# EAGLE design DevShield2.7.1 (EAGLE 6.4)
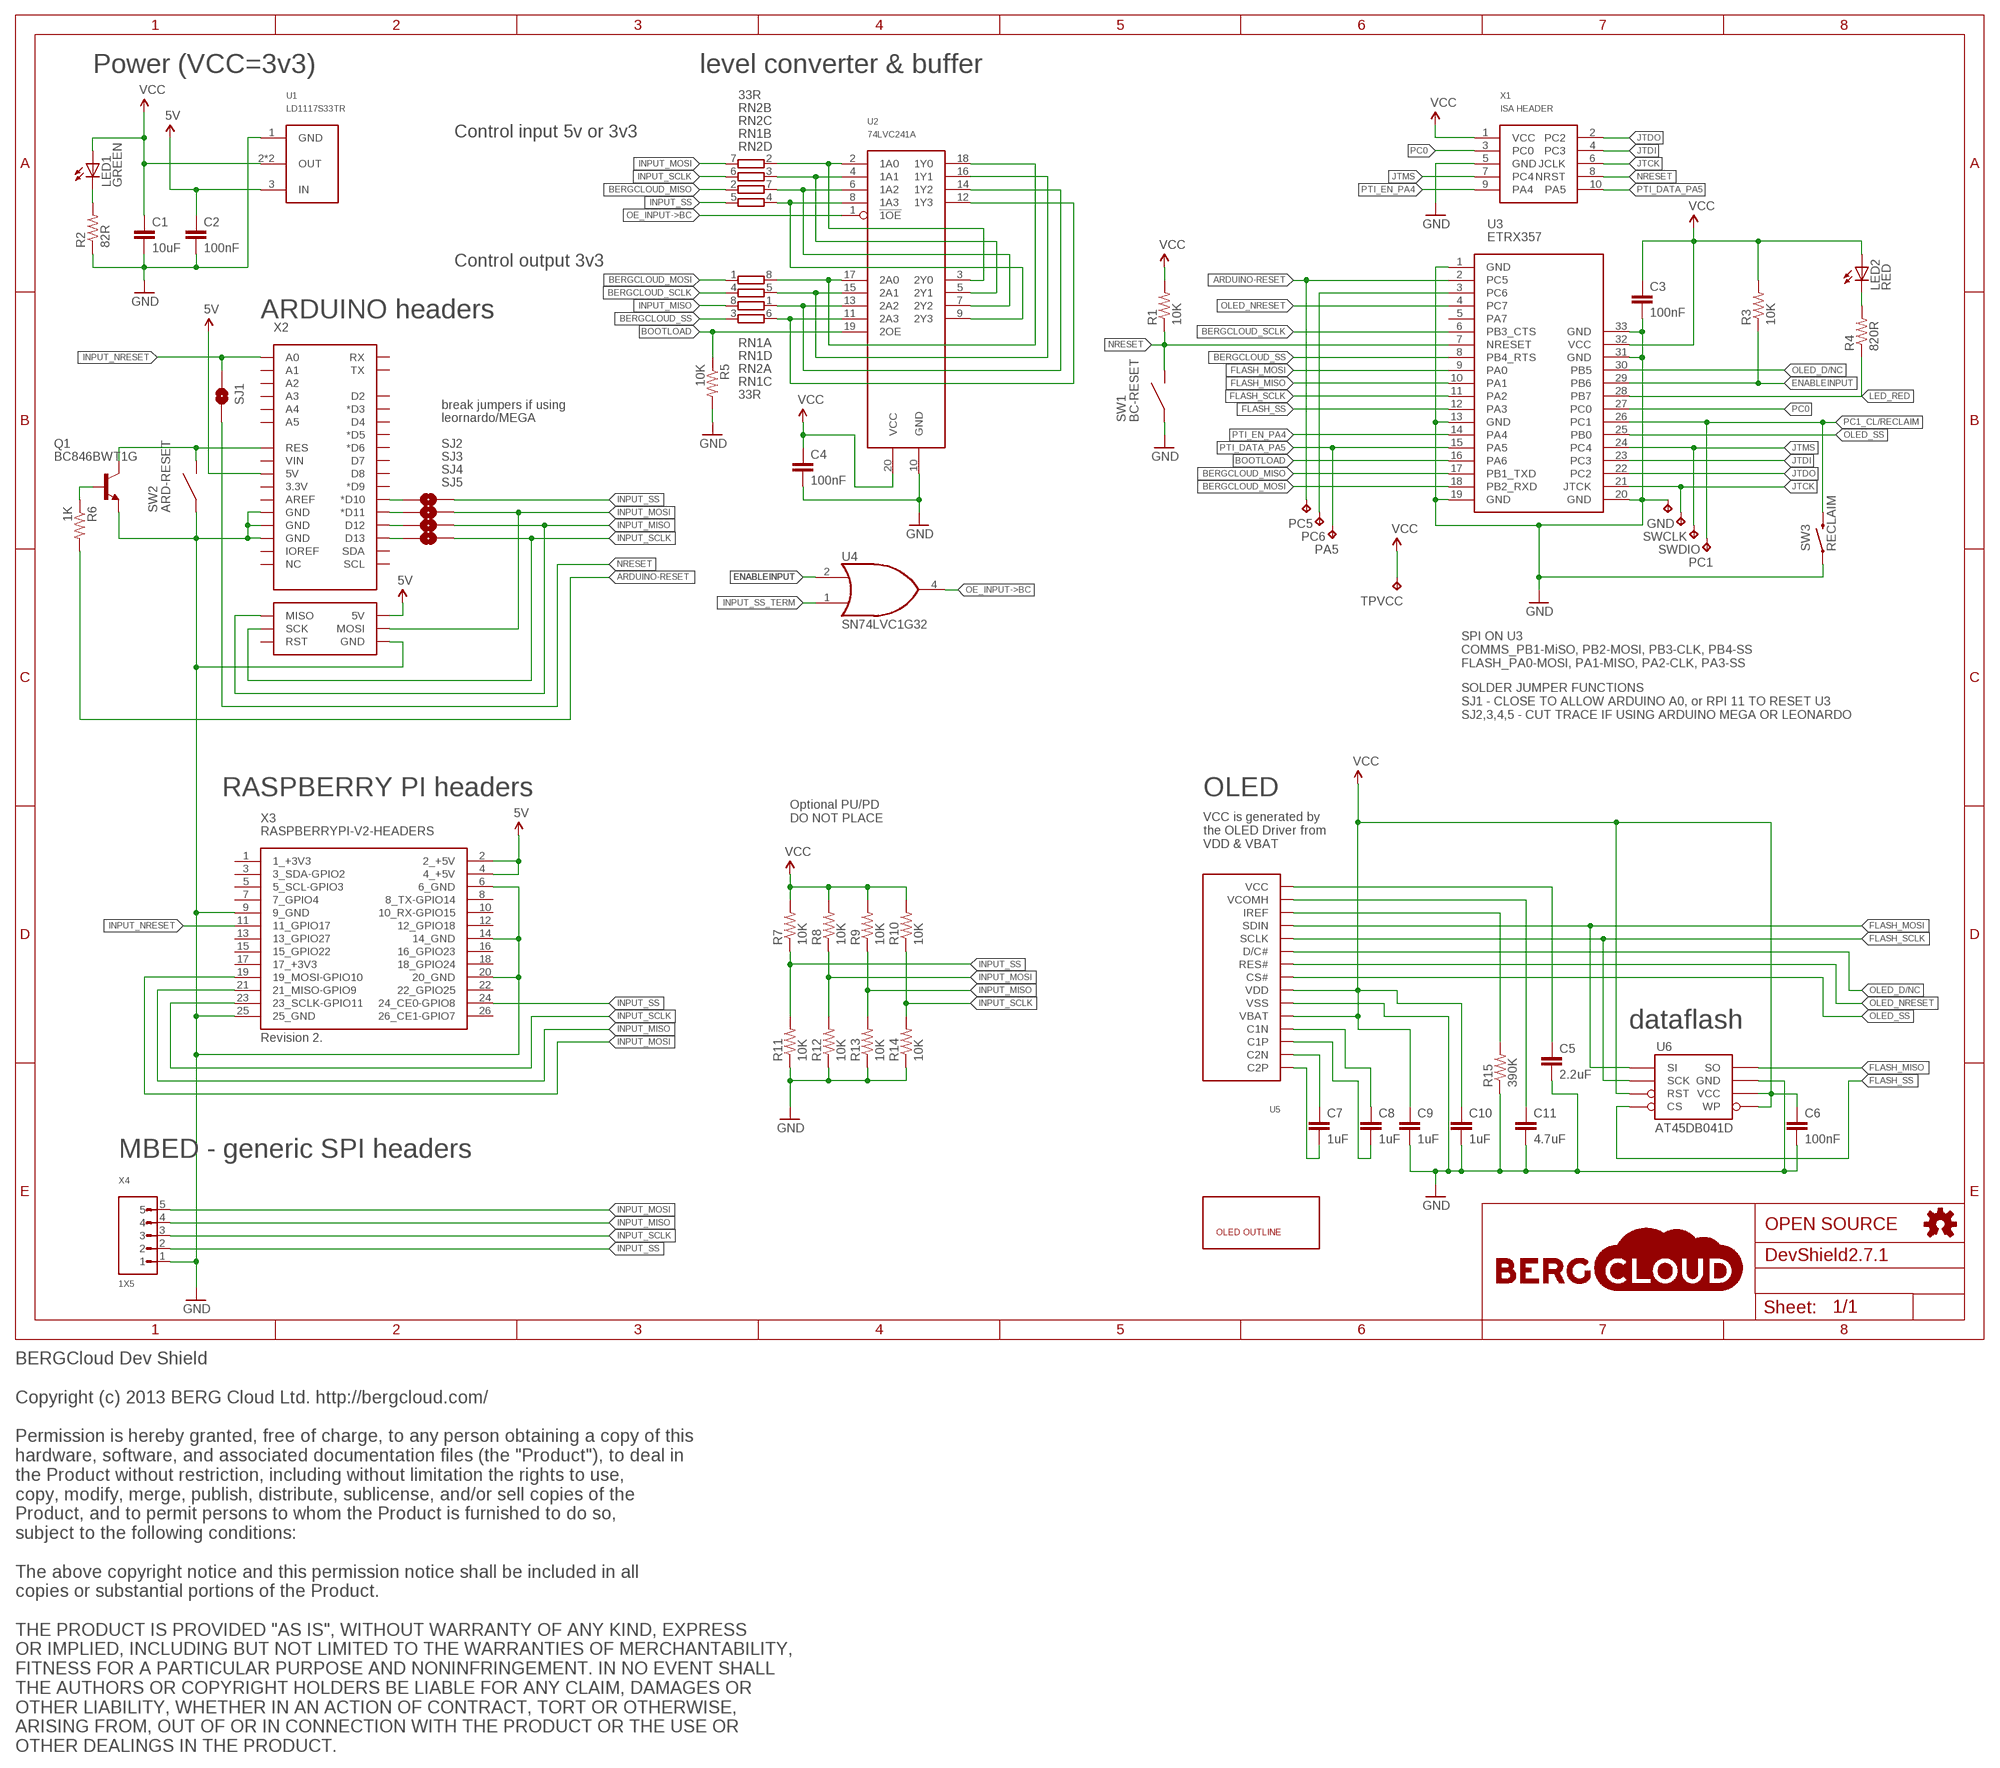
[diagram p0: schematic, sheet 1]

## Parts
C1  10uF  C-EUC0805K  [C0805K]
C2  100nF  C-EUC0603K  [C0603K]
C3  100nF  C-EUC0603K  [C0603K]
C4  100nF  C-EUC0603K  [C0603K]
C5  2.2uF  CAP0603-CAP  [0603-CAP]
C6  100nF  C-EUC0603K  [C0603K]
C7  1uF  CAP0603-CAP  [0603-CAP]
C8  1uF  CAP0603-CAP  [0603-CAP]
C9  1uF  CAP0603-CAP  [0603-CAP]
C10  1uF  CAP0603-CAP  [0603-CAP]
C11  4.7uF  CAP0805  [0805]
GND  TPTP15R  [TP15R]
IGNORE  ER-OLED0.91-1-OUTLINE  [ER-OLED0.91-SCREEN]
LED1  GREEN  LEDCHIPLED_0603  [CHIPLED_0603]
LED2  RED  LEDCHIPLED_0603  [CHIPLED_0603]
PA5  TPTP15R  [TP15R]
PC1  TPTP15R  [TP15R]
PC5  TPTP15R  [TP15R]
PC6  TPTP15R  [TP15R]
Q1  BC846BWT1G  [SOT323]
R1  10K  RESISTOR0603-RES  [0603-RES]
R2  82R  RESISTOR0603-RES  [0603-RES]
R3  10K  RESISTOR0603-RES  [0603-RES]
R4  820R  RESISTOR0603-RES  [0603-RES]
R5  10K  RESISTOR0603-RES  [0603-RES]
R6  1K  RESISTOR0603-RES  [0603-RES]
R7  10K  RESISTOR0603-RES  [0603-RES]
R8  10K  RESISTOR0603-RES  [0603-RES]
R9  10K  RESISTOR0603-RES  [0603-RES]
R10  10K  RESISTOR0603-RES  [0603-RES]
R11  10K  RESISTOR0603-RES  [0603-RES]
R12  10K  RESISTOR0603-RES  [0603-RES]
R13  10K  RESISTOR0603-RES  [0603-RES]
R14  10K  RESISTOR0603-RES  [0603-RES]
R15  390K  RESISTOR0603-RES  [0603-RES]
RN1  33R  4R-NCAT16  [CAT16]
RN2  33R  4R-NCAT16  [CAT16]
SJ1  SOLDERJUMPERNO  [SJ_2S-NO]
SJ2  SOLDERJUMPERTRACE  [SJ_2S-TRACE]
SJ3  SOLDERJUMPERTRACE  [SJ_2S-TRACE]
SJ4  SOLDERJUMPERTRACE  [SJ_2S-TRACE]
SJ5  SOLDERJUMPERTRACE  [SJ_2S-TRACE]
SW1  BC-RESET  SPST  [TE_FSMSM]
SW2  ARD-RESET  SPST  [TE_FSMSM]
SW3  RECLAIM  SWITCH-MOMENTARY-2SMD  [TACTILE_SWITCH_SMD]
SWCLK  TPTP15R  [TP15R]
SWDIO  TPTP15R  [TP15R]
TPVCC  TPTP15R  [TP15R]
U1  LD1117S33TR  [SOT223]
U2  74LVC241A  74LVC241APW  [TSSOP20]
U3  ETRX357  ETRX35XMODULE-SMD  [ETRX35XSMD]
U4  SN74LVC1G32  74LVC1G32  [SC70-5]
U5  ER-OLED0.91-1HANDSOLDER_BOTTOMLAYER  [FPC15WAYOLED]
U6  AT45DB041D  AT45DB041B  [SO08]
X1  ISA HEADER  EMBER_ISASHROUDED-1.27MM  [SHF-105-01-L-D-SM]
X2  ARDUINO_UNO_IO_INCL_ICSP  [ARDUINO_UNO_ICSP]
X3  RASPBERRYPI-V2-HEADERS  RASPBERRY-PIHEADERS  [13X2_2.54MM]
X4  1X5  [1X05]

## Nets
5V: C2.1 U1.3(IN) X2.5V@0(5V) X2.ICSP_5V(5V) X3.2(2_+5V) X3.4(4_+5V)
ARD_RESET_5V: Q1.3(C) SW2.P$1 X2.RES
ARDUINO-RESET: PC5.TP R6.2 U3.2(PC5)
BERGCLOUD_MISO: RN1.2 U3.17(PB1_TXD)
BERGCLOUD_MISO_TERM: RN1.7 U2.6(1A2) U2.7(2Y2)
BERGCLOUD_MOSI: RN1.1 U3.18(PB2_RXD)
BERGCLOUD_MOSI_TERM: RN1.8 U2.17(2A0) U2.18(1Y0)
BERGCLOUD_SCLK: RN1.4 U3.6(PB3_CTS)
BERGCLOUD_SCLK_TERM: RN1.5 U2.15(2A1) U2.16(1Y1)
BERGCLOUD_SS: RN1.3 U3.8(PB4_RTS)
BERGCLOUD_SS_TERM: RN1.6 U2.11(2A3) U2.12(1Y3)
BOOTLOAD: R5.1 U2.19(2OE) U3.16(PA6)
ENABLEINPUT: R3.1 U3.29(PB6) U4.2(I0)
FLASH_MISO: U3.10(PA1) U6.8(SO)
FLASH_MOSI: U3.9(PA0) U5.P$12(SDIN) U6.1(SI)
FLASH_SCLK: U3.11(PA2) U5.P$11(SCLK) U6.2(SCK)
FLASH_SS: U3.12(PA3) U6.4(CS)
GND: C1.2 C2.2 C3.2 C4.2 C5.2 C6.2 C9.2 C10.2 C11.2 GND.TP Q1.2(E) R2.1 R5.2 R11.1 R12.1 R13.1 R14.1 R15.1 SW1.P$2 SW2.P$2 SW3.1 U1.1(GND) U2.10(GND) U3.1(GND) U3.13(GND) U3.19(GND) U3.20(GND) U3.31(GND) U3.33(GND) U5.P$6(VSS) U6.7(GND) X1.5(GND) X2.GND@0(GND) X2.GND@1(GND) X2.GND@2(GND) X2.GND@03(GND) X3.6(6_GND) X3.9(9_GND) X3.14(14_GND) X3.20(20_GND) X3.25(25_GND) X4.1
INPUT_MISO: R9.1 R13.2 RN2.8 SJ4.2 X2.ICSP_MISO(MISO) X3.21(21_MISO-GPIO9) X4.4
INPUT_MISO_TERM: RN2.1 U2.13(2A2) U2.14(1Y2)
INPUT_MOSI: R8.1 R12.2 RN2.7 SJ3.2 X2.ICSP_MOSI(MOSI) X3.19(19_MOSI-GPIO10) X4.5
INPUT_MOSI_TERM: RN2.2 U2.2(1A0) U2.3(2Y0)
INPUT_NRESET: SJ1.1 X2.A0 X3.11(11_GPIO17)
INPUT_SCLK: R10.1 R14.2 RN2.6 SJ5.2 X2.ICSP_SCK(SCK) X3.23(23_SCLK-GPIO11) X4.3
INPUT_SCLK_TERM: RN2.3 U2.4(1A1) U2.5(2Y1)
INPUT_SS: R7.1 R11.2 RN2.5 SJ2.2 X3.24(24_CE0-GPIO8) X4.2
INPUT_SS_TERM: RN2.4 U2.8(1A3) U2.9(2Y3) U4.1(I1)
JTCK: SWCLK.TP U3.21(JTCK) X1.6(JCLK)
JTDI: U3.23(PC3) X1.4(PC3)
JTDO: U3.22(PC2) X1.2(PC2)
JTMS: SWDIO.TP U3.24(PC4) X1.7(PC4)
LED_RED: R4.1 U3.28(PB7)
N$1: LED1.C R2.2
N$3: SJ2.1 X2.D10(*D10)
N$4: SJ3.1 X2.D11(*D11)
N$5: SJ4.1 X2.D12
N$6: SJ5.1 X2.D13
N$8: C7.1 U5.P$2(C2N)
N$9: C7.2 U5.P$1(C2P)
N$10: C8.2 U5.P$3(C1P)
N$11: LED2.C R4.2
N$12: C8.1 U5.P$4(C1N)
N$14: C5.1 U5.P$15(VCC)
N$18: C11.1 U5.P$14(VCOMH)
N$19: R15.2 U5.P$13(IREF)
N$20: Q1.1(B) R6.1
NRESET: R1.1 SJ1.2 SW1.P$1 U3.7(NRESET) X1.8(NRST)
OE_INPUT->BC: U2.1(!1OE) U4.4(O)
OLED_D/NC: U3.30(PB5) U5.P$10(D/C#)
OLED_NRESET: U3.4(PC7) U5.P$9(RES#)
OLED_SS: U3.25(PB0) U5.P$8(CS#)
PC0: U3.27(PC0) X1.3(PC0)
PC1_CL/RECLAIM: PC1.TP SW3.3 U3.26(PC1)
PC6: PC6.TP U3.3(PC6)
PTI_DATA_PA5: PA5.TP U3.15(PA5) X1.10(PA5)
PTI_EN_PA4: U3.14(PA4) X1.9(PA4)
VCC: C1.1 C3.1 C4.1 C6.1 C9.1 C10.1 LED1.A LED2.A R1.2 R3.2 R7.2 R8.2 R9.2 R10.2 TPVCC.TP U1.2(OUT) U1.4(OUT) U2.20(VCC) U3.32(VCC) U5.P$5(VBAT) U5.P$7(VDD) U6.3(RST) U6.5(WP) U6.6(VCC) X1.1(VCC)
Unconnected: U3.5(PA7) X2.3.3V X2.A1 X2.A2 X2.A3 X2.A4 X2.A5 X2.AREF X2.D2 X2.D3(*D3) X2.D4 X2.D5(*D5) X2.D6(*D6) X2.D7 X2.D8 X2.D9(*D9) X2.ICSP_RST(RST) X2.IOREF X2.NC X2.RX X2.SCL X2.SDA X2.TX X2.VIN X3.1(1_+3V3) X3.3(3_SDA-GPIO2) X3.5(5_SCL-GPIO3) X3.7(7_GPIO4) X3.8(8_TX-GPIO14) X3.10(10_RX-GPIO15) X3.12(12_GPIO18) X3.13(13_GPIO27) X3.15(15_GPIO22) X3.16(16_GPIO23) X3.17(17_+3V3) X3.18(18_GPIO24) X3.22(22_GPIO25) X3.26(26_CE1-GPIO7)

## Notes on the sheet
- Power (VCC=3v3) | level converter & buffer
- Control input 5v or 3v3
- Control output 3v3
- ARDUINO headers
- break jumpers if using
- leornardo/MEGA
- SPI ON U3
  COMMS_PB1-MiSO, PB2-MOSI, PB3-CLK, PB4-SS
  FLASH_PA0-MOSI, PA1-MISO, PA2-CLK, PA3-SS
- SOLDER JUMPER FUNCTIONS
  SJ1 - CLOSE TO ALLOW ARDUINO A0, or RPI 11 TO RESET U3
  SJ2,3,4,5 - CUT TRACE IF USING ARDUINO MEGA OR LEONARDO
- RASPBERRY PI headers | OLED
- Optional PU/PD
  DO NOT PLACE
- VCC is generated by 
  the OLED Driver from 
  VDD & VBAT
- dataflash
- MBED - generic SPI headers
- BERGCloud Dev Shield
  
  Copyright (c) 2013 BERG Cloud Ltd. http://bergcloud.com/
  
  Permission is hereby granted, free of charge, to any person obtaining a copy of this 
  hardware, software, and associated documentation files (the "Product"), to deal in 
  the Product without restriction, including without limitation the rights to use, 
  copy, modify, merge, publish, distribute, sublicense, and/or sell copies of the 
  Product, and to permit persons to whom the Product is furnished to do so, 
  subject to the following conditions:
  
  The above copyright notice and this permission notice shall be included in all 
  copies or substantial portions of the Product.
  
  THE PRODUCT IS PROVIDED "AS IS", WITHOUT WARRANTY OF ANY KIND, EXPRESS 
  OR IMPLIED, INCLUDING BUT NOT LIMITED TO THE WARRANTIES OF MERCHANTABILITY, 
  FITNESS FOR A PARTICULAR PURPOSE AND NONINFRINGEMENT. IN NO EVENT SHALL 
  THE AUTHORS OR COPYRIGHT HOLDERS BE LIABLE FOR ANY CLAIM, DAMAGES OR
  OTHER LIABILITY, WHETHER IN AN ACTION OF CONTRACT, TORT OR OTHERWISE, 
  ARISING FROM, OUT OF OR IN CONNECTION WITH THE PRODUCT OR THE USE OR 
  OTHER DEALINGS IN THE PRODUCT.

## Power pins joined to a net without a drawn wire
GND: U4.3(GND)
VCC: U4.5(VCC)

## Library data of the parts
C1-C4 C6 = rcl:C-EU: CAPACITOR, European symbol; MF: AVX; MPN: 06033C104KAZ2A; OC_FARNELL: 1833840
C5 = SparkFun:CAP: Capacitor Standard 0603 ceramic capacitor, and 0.1" leaded capacitor.; MF: AVX; MPN: 06036D225KAT2A; OC_FARNELL: 1327678
C7-C10 = SparkFun:CAP: Capacitor Standard 0603 ceramic capacitor, and 0.1" leaded capacitor.; MF: AVX; MPN: 02016D105MAT2A; OC_FARNELL: 1867951RL
C11 = SparkFun:CAP: Capacitor Standard 0603 ceramic capacitor, and 0.1" leaded capacitor.; MF: AVX; MPN: 0805ZD475KAT2A; OC_FARNELL: 1327701
GND PA5 PC1 PC5 PC6 SWCLK SWDIO TPVCC = testpad:TP: Test pad; OC_FARNELL: unknown
IGNORE = BERGCloud-OSH:ER-OLED0.91-1-OUTLINE: Handy screen placement info for the 1.9" 128x32 pixel OLED display of types: ER-OLED0.91-1 UG-2832HSWEG04 Created by AH. BERG Cloud <http://www.bergcloud.com>; OC_FARNELL: unknown
LED1 LED2 = led:LED: LED OSRAM: - CHIPLED LG R971, LG N971, LY N971, LG Q971, LY Q971, LO R971, LY R971 LH N974, LH R974 LS Q976, LO Q976, LY Q976 LO Q996 - Hyper CHIPLED LW Q18S LB Q993, LB Q99A, LB R99A - SideLED LS A670, LO A670, LY A670, LG A670, LP A670 LB A673, LV A673, LT A673, LW A673 LH A674 LY A675 LS A676, LA A676, LO A676, LY A676, LW A676 LS A679, LY A679, LG A679 - Hyper Micro SIDELED® LS Y876, LA Y876, LO Y876, LY Y876 LT Y87S - SmartLED LW L88C, LW L88S LB L89C, LB L89S, LG L890 LS L89K, LO L89K, LY L89K LS L896, LA L896, LO L896, LY L896 - TOPLED LS T670, LO T670, LY T670, LG T670, LP T670 LSG T670, LSP T670, LSY T670, LOP T670, LYG T670 LG T671, LOG T671, LSG T671 LB T673, LV T673, LT T673, LW T673 LH T674 LS T676, LA T676, LO T676, LY T676, LB T676, LH T676, LSB T676, LW T676 LB T67C, LV T67C, LT T67C, LS T67K, LO T67K, LY T67K, LW E67C LS E67B, LA E67B, LO E67B, LY E67B, LB E67C, LV E67C, LT E67C LW T67C LS T679, LY T679, LG T679 LS T770, LO T770, LY T770, LG T770, LP T770 LB T773, LV T773, LT T773, LW T773 LH T774 LS E675, LA E675, LY E675, LS T675 LS T776, LA T776, LO T776, LY T776, LB T776 LHGB T686 LT T68C, LB T68C - Hyper Mini TOPLED® LB M676 - Mini TOPLED Santana® LG M470 LS M47K, LO M47K, LY M47K Source: http://www.osram.convergy.de LUXEON: - LUMILED® LXK2-PW12-R00, LXK2-PW12-S00, LXK2-PW14-U00, LXK2-PW14-V00 LXK2-PM12-R00, LXK2-PM12-S00, LXK2-PM14-U00 LXK2-PE12-Q00, LXK2-PE12-R00, LXK2-PE12-S00, LXK2-PE14-T00, LXK2-PE14-U00 LXK2-PB12-K00, LXK2-PB12-L00, LXK2-PB12-M00, LXK2-PB14-N00, LXK2-PB14-P00, LXK2-PB14-Q00 LXK2-PR12-L00, LXK2-PR12-M00, LXK2-PR14-Q00, LXK2-PR14-R00 LXK2-PD12-Q00, LXK2-PD12-R00, LXK2-PD12-S00 LXK2-PH12-R00, LXK2-PH12-S00 LXK2-PL12-P00, LXK2-PL12-Q00, LXK2-PL12-R00 Source: www.luxeon.com KINGBRIGHT: KA-3528ASYC Source: www.kingbright.com; MF: AVAGO TECHNOLOGIES; MPN: ASMT-RH45-AQ502; OC_FARNELL: 1652079
Q1 = BERGCloud-OSH:BC846: Transistor NPN eg. On Semiconductor <http://onsemi.com> BC846BWT1G. Created by AH. BERG Cloud <http://www.bergcloud.com>; MF: ON SEMICONDUCTOR; MPN: BC846BWT1G; OC_FARNELL: 1653606
R1-R5 R7-R14 = SparkFun:RESISTOR: Resistor Basic schematic elements and footprints for 0603, 1206, and PTH 1/10th watt (small) resistors.; OC_FARNELL: unknown
R6 = SparkFun:RESISTOR: Resistor Basic schematic elements and footprints for 0603, 1206, and PTH 1/10th watt (small) resistors.; MF: MULTICOMP; MPN: MC0063W060311K; OC_FARNELL: 9330380
R15 = SparkFun:RESISTOR: Resistor Basic schematic elements and footprints for 0603, 1206, and PTH 1/10th watt (small) resistors.; MF: PANASONIC; MPN: ERJU03F3903V; OC_FARNELL: 2145384
RN1 RN2 = resistor-dil:4R-N: Array Chip Resistor Source: RS Component / Phycomp; OC_FARNELL: unknown; OC_NEWARK: unknown
SJ1-SJ5 = SparkFun:SOLDERJUMPER: Solder Jumper Standard SMD solder jumper. Used to automate production. Two varients : Normally Open and Normally Closed are the same, but have different paste layers. NC will have a large amount of paste and should jumper during reflow.; OC_FARNELL: unknown
SW1 SW2 = BERGCloud-OSH:SPST: SPST Switch eg. TE CONNECTIVITY / ALCOSWITCH FSMSM - TACTILE SWITCH Created by AH. BERG Cloud <http://www.bergcloud.com>; MF: TE CONNECTIVITY / ALCOSWITCH; MPN: FSMSM; OC_FARNELL: 1703878
SW3 = SparkFun:SWITCH-MOMENTARY-2; OC_FARNELL: unknown
U1 = BERGCloud-OSH:LD1117S33TR: LD1117xx, Series Voltage Regulator. Created by AH. BERG Cloud <http://www.bergcloud.com>
U2 = BERGCloud-OSH:74LVC241A: NXP <http://nxp.com> 74LVC241A Octal buffer/line driver with 5 V tolerant inputs/outputs; 3-state. TSSOP20 = 74LVC241APW Created by AH. BERG Cloud <http://www.bergcloud.com>; OC_FARNELL: unknown
U3 = BERGCloud-OSH:ETRX35X: Telegesis ETRX35X Zigbee module <http://www.telegesis.com/product_range_overview/etrx3_zigbee_module.htm> Created by AH. BERG Cloud <http://www.bergcloud.com>; OC_FARNELL: unknown
U4 = BERGCloud-OSH:74*1G32: 2-input OR gate; MF: TEXAS INSTRUMENTS; MPN: SN74LVC1G32DCKR; OC_FARNELL: 1470880
U5 = BERGCloud-OSH:ER-OLED0.91-1: 1.9" 128x32 pixel OLED display of types: ER-OLED0.91-1 UG-2832HSWEG04 Created by AH. BERG Cloud <http://www.bergcloud.com>; OC_FARNELL: unknown
U6 = SparkFun:AT45DB041B; MF: ADESTO TECHNOLOGIES; MPN: AT45DB041D-SSU; OC_FARNELL: 1455037
X1 = BERGCloud-OSH:EMBER_ISA: Ember ISA programming/debug headers. Created by AH. BERG Cloud <http://www.bergcloud.com>; OC_FARNELL: unknown
X2 = BERGCloud-OSH:ARDUINO_UNO_IO_INCL_ICSP: Arduino <http://arduino.cc> shield IO pins for R3 Uno boards/Leonardo including ICSP headers for SPI to enable MEGA usage. Created by AH. BERG Cloud <http://www.bergcloud.com>; OC_FARNELL: unknown
X3 = BERGCloud-OSH:RASPBERRY-PI: Headers for the Raspberry Pi Board <http://www.raspberrypi.org/> v2. GPIO Connector (P1): http://elinux.org/RPi_Low-level_peripherals Based on .lbr designed by Jacques Lagnel in 2012. Created by AH. BERG Cloud <http://www.bergcloud.com>; OC_FARNELL: unknown
X4 = BERGCloud-OSH:1X5; OC_FARNELL: unknown

## Board
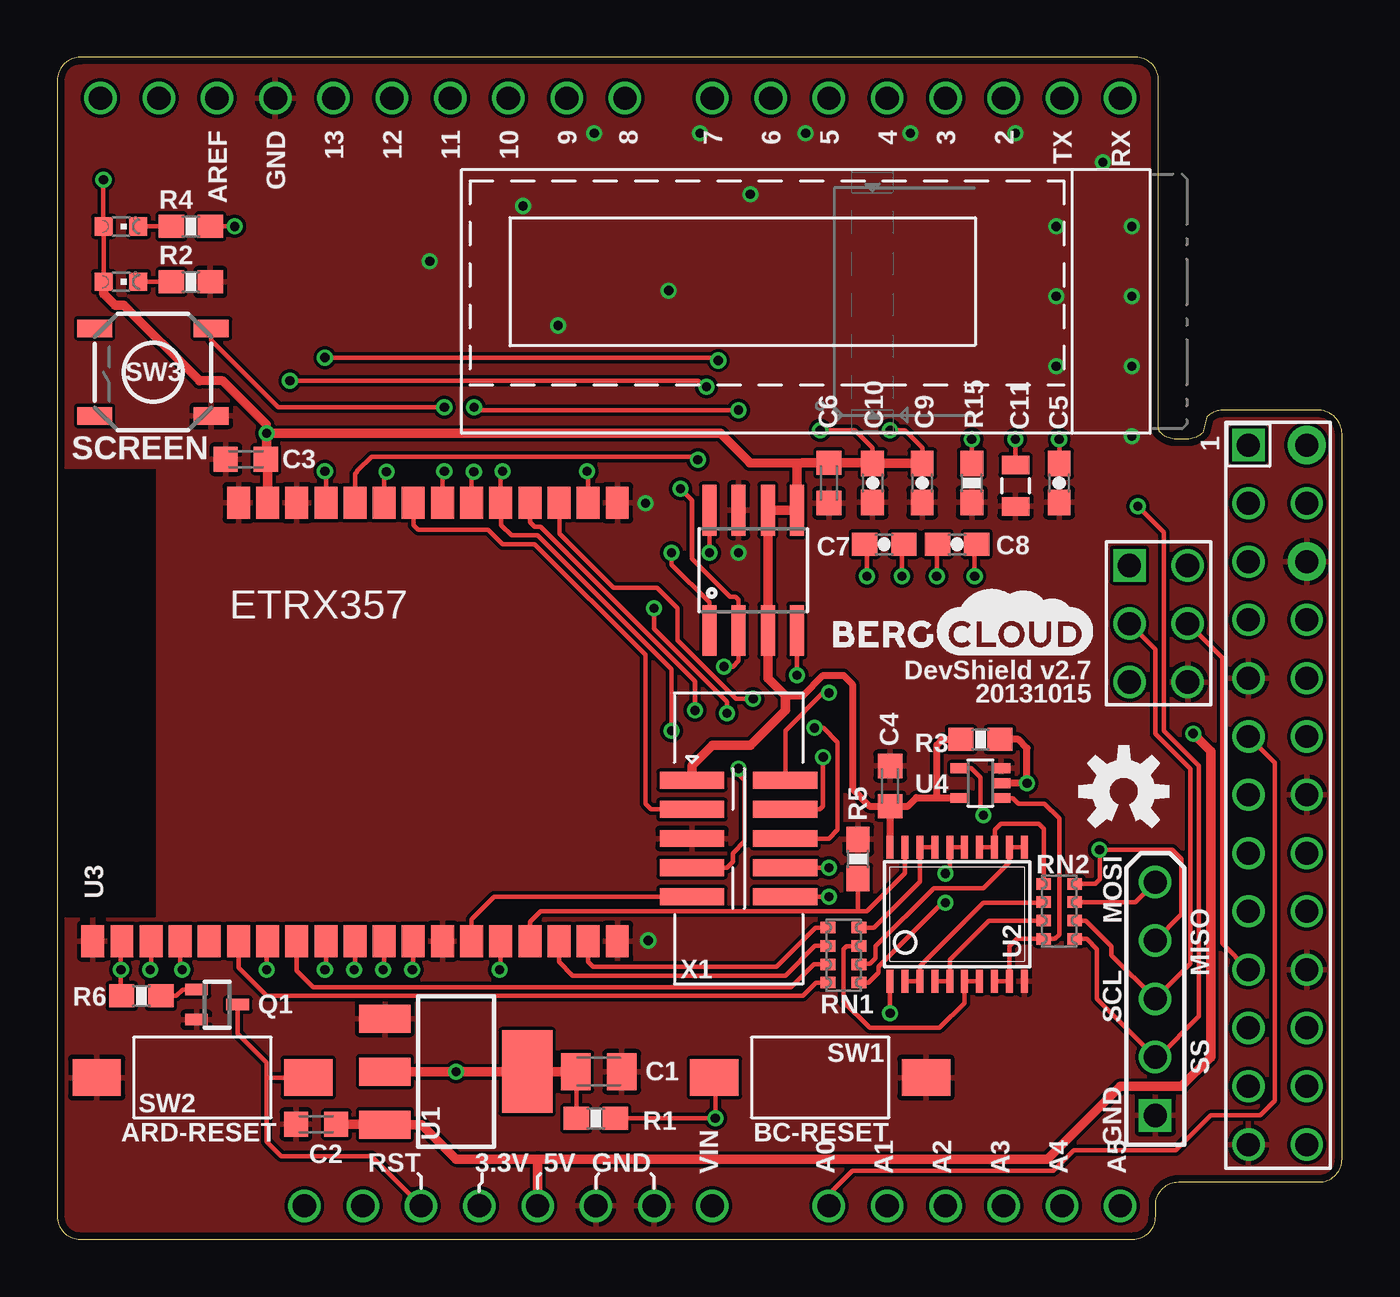
[diagram p1: board, top side]
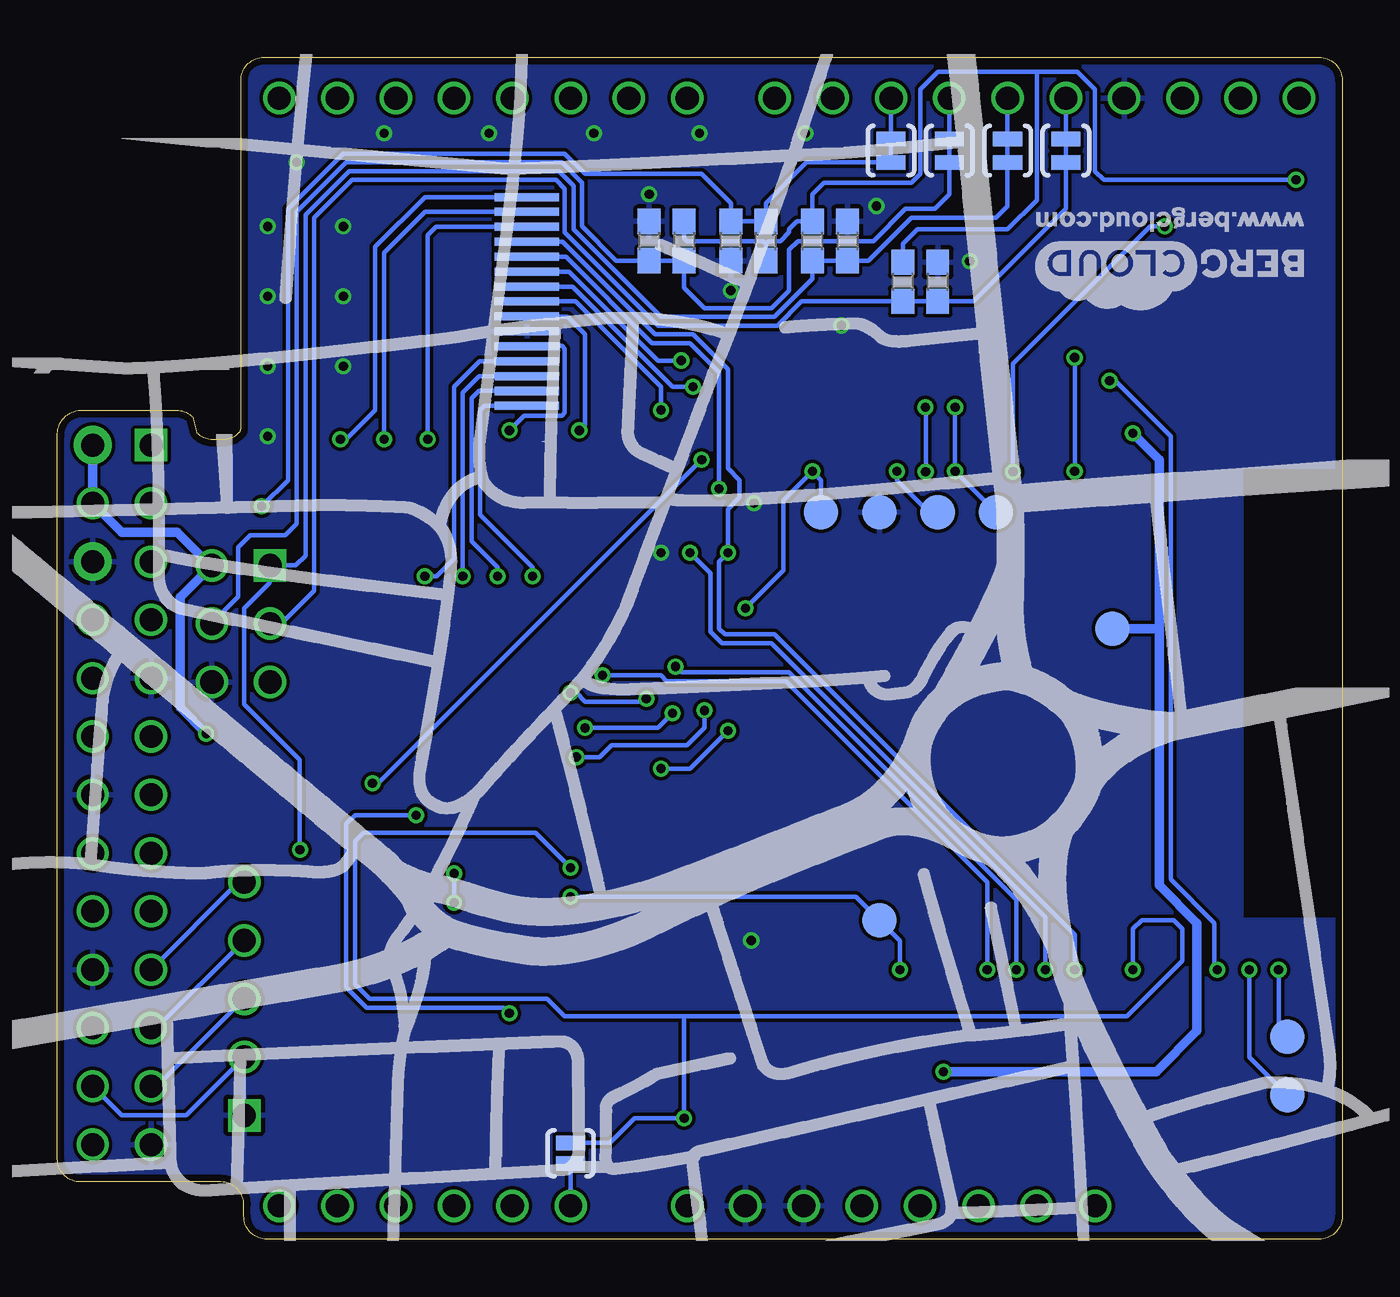
[diagram p2: board, bottom side, seen from below]

Size 56 x 51.5 mm. Coordinates in mm from the lower left corner, seen from the top.
Outline: 48,50.5 arc90 47,51.5 1,51.5 arc90 0,50.5 0,1 arc90 1,0 46.87,0 arc90 47.87,1 47.87,1.5 arc-90 48.87,2.5 55,2.5 arc90 56,3.5 56,35 arc90 55,36.13 50.81,36.13 arc45 50.1,35.84 49.93,35.15 arc-45 49.22,34.86 48.78,34.86 arc-45 48.07,35.16 arc-45 48,35.33 48,50.5
Copper layers (1*16): Top 0.035mm / dielectric 1.5mm / Bottom 0.035mm
Design rules "PCB-POOL Standard-buriedVias *": minimum track width 0.15mm, minimum drill 0.3mm, track to track 0.15mm, track to pad 0.15mm, pad to pad 0.15mm, via to via 0.15mm, smd to smd 0.15mm, copper to edge 0.3mm, drill to drill 0.2mm, minimum pad ring 0.2mm, minimum via ring 0.15mm, stop-mask expansion 0.075mm, vias tented up to drill 0.4mm, thermal gap 0.2mm

### Footprints (pad centres in the part's own frame; a part is rotated, then mirrored left to right if it is on the bottom)
C0805K = smd 1.3 x 1.6: 1 -1,0; 2 1,0
C0603K = smd 1.05 x 1.08: 1 -0.875,0; 2 0.875,0
0603-CAP = smd 1.1 x 1: 1 -0.85,0; 2 0.85,0
0805 = smd 0.8 x 1.2: 1 -0.9,0; 2 0.9,0
TP15R = smd 1.5 x 1.5: TP 0,0
CHIPLED_0603 = smd 0.8 x 0.8: A 0,-0.75; C 0,0.75
SOT323 = smd 0.5 x 1: 1 -0.65,-0.9; 2 0.65,-0.9; 3 0,0.9
0603-RES = smd 1.1 x 1: 1 -0.85,0; 2 0.85,0
CAT16 = smd 0.5 x 0.65: 1 -1.2,-0.675; 2 -0.4,-0.675; 3 0.4,-0.675; 4 1.2,-0.675; 5 1.2,0.675; 6 0.4,0.675; 7 -0.4,0.675; 8 -1.2,0.675
SJ_2S-NO = smd 0.635 x 1.27: 1 -0.45,0; 2 0.45,0
SJ_2S-TRACE = smd 0.635 x 1.27: 1 -0.508,0; 2 0.508,0
TE_FSMSM = smd 2.11 x 1.6: P$1 -4.61,0; P$2 4.61,0
TACTILE_SWITCH_SMD = smd 1.524 x 0.762: 1 -2.54,1.905; 2 2.54,1.905; 3 -2.54,-1.905; 4 2.54,-1.905
SOT223 = smd 1.219 x 2.235: 1 -2.311,-3.099; 2 0,-3.099; 3 2.311,-3.099 | smd 3.6 x 2.2: 4 0,3.099
TSSOP20 = smd 0.305 x 0.991: 1 -2.925,-2.918; 2 -2.275,-2.918; 3 -1.625,-2.918; 4 -0.975,-2.918; 5 -0.325,-2.918; 6 0.325,-2.918; 7 0.975,-2.918; 8 1.625,-2.918; 9 2.275,-2.918; 10 2.925,-2.918; 11 2.925,2.918; 12 2.275,2.918; 13 1.625,2.918; 14 0.975,2.918; 15 0.325,2.918; 16 -0.325,2.918; 17 -0.975,2.918; 18 -1.625,2.918; 19 -2.275,2.918; 20 -2.925,2.918
ETRX35XSMD = smd 1 x 1.4: 1 -10.75,-9.55; 2 -9.48,-9.55; 3 -8.21,-9.55; 4 -6.94,-9.55; 5 -5.67,-9.55; 6 -4.4,-9.55; 7 -3.13,-9.55; 8 -1.86,-9.55; 9 -0.59,-9.55; 10 0.68,-9.55; 11 1.95,-9.55; 12 3.22,-9.55; 13 4.49,-9.55; 14 5.76,-9.55; 15 7.03,-9.55; 16 8.3,-9.55; 17 9.57,-9.55; 18 10.84,-9.55; 19 12.11,-9.55; 20 12.11,9.55; 21 10.84,9.55; 22 9.57,9.55; 23 8.3,9.55; 24 7.03,9.55; 25 5.76,9.55; 26 4.49,9.55; 27 3.22,9.55; 28 1.95,9.55; 29 0.68,9.55; 30 -0.59,9.55; 31 -1.86,9.55; 32 -3.13,9.55; 33 -4.4,9.55
SC70-5 = smd 0.425 x 0.8: 1 -0.65,-0.9; 2 0,-0.9; 3 0.65,-0.9; 4 0.65,0.9; 5 -0.65,0.9
FPC15WAYOLED = smd 2.8 x 0.35: P$1 0,-4.55; P$2 0,-3.9; P$3 0,-3.25; P$4 0,-2.6; P$5 0,-1.95; P$6 0,-1.3; P$7 0,-0.65; P$8 0,0; P$9 0,0.65; P$10 0,1.3; P$11 0,1.95; P$12 0,2.6; P$13 0,3.25; P$14 0,3.9; P$15 0,4.55
SO08 = smd 0.61 x 2.21: 1 -1.905,-2.616; 2 -0.635,-2.616; 3 0.635,-2.616; 4 1.905,-2.616; 5 1.905,2.616; 6 0.635,2.616; 7 -0.635,2.616; 8 -1.905,2.616
SHF-105-01-L-D-SM = smd 0.737 x 2.794: 1 -2.54,-2.032; 2 -2.54,2.032; 3 -1.27,-2.032; 4 -1.27,2.032; 5 0,-2.032; 6 0,2.032; 7 1.27,-2.032; 8 1.27,2.032; 9 2.54,-2.032; 10 2.54,2.032
ARDUINO_UNO_ICSP = drill 1.016: 3.3V 16.51,-48.26; 5V@0 19.05,-48.26; A0 31.75,-48.26; A1 34.29,-48.26; A2 36.83,-48.26; A3 39.37,-48.26; A4 41.91,-48.26; A5 44.45,-48.26; AREF 5.08,0; D2 39.37,0; D3 36.83,0; D4 34.29,0; D5 31.75,0; D6 29.21,0; D7 26.67,0; D8 22.86,0; D9 20.32,0; D10 17.78,0; D11 15.24,0; D12 12.7,0; D13 10.16,0; GND@0 21.59,-48.26; GND@1 24.13,-48.26; GND@2 7.62,0; GND@03 47.384,-25.44; ICSP_5V 47.384,-20.36; ICSP_MOSI 47.384,-22.9; ICSP_RST 44.844,-25.44; ICSP_SCK 44.844,-22.9; IOREF 11.43,-48.26; NC 8.89,-48.26; RES 13.97,-48.26; RX 44.45,0; SCL 0,0; SDA 2.54,0; TX 41.91,0; VIN 26.67,-48.26 | drill 1.016 square: ICSP_MISO 44.844,-20.36
13X2_2.54MM = drill 1 square: 1 -15.24,-1.27 | drill 1 pad 1.676: 2 -15.24,1.27; 6 -10.16,1.27 | drill 1: 3 -12.7,-1.27; 4 -12.7,1.27; 5 -10.16,-1.27; 7 -7.62,-1.27; 8 -7.62,1.27; 9 -5.08,-1.27; 10 -5.08,1.27; 11 -2.54,-1.27; 12 -2.54,1.27; 13 0,-1.27; 14 0,1.27; 15 2.54,-1.27; 16 2.54,1.27; 17 5.08,-1.27; 18 5.08,1.27; 19 7.62,-1.27; 20 7.62,1.27; 21 10.16,-1.27; 22 10.16,1.27; 23 12.7,-1.27; 24 12.7,1.27; 25 15.24,-1.27; 26 15.24,1.27
1X05 = drill 1.016 square: 1 0,0 | drill 1.016: 2 2.54,0; 3 5.08,0; 4 7.62,0; 5 10.16,0

### Placement (x,y rotation side)
C1  23.6,7.3 0 top
C2  11.28,5.02 180 top
C3  8.22,33.99 180 top
C4  36.3,19.75 90 top
C5  43.66,32.96 270 top
C6  33.63,32.96 270 top
C7  36.05,30.29 180 top
C8  39.22,30.29 180 top
C9  37.7,32.96 270 top
C10  35.54,32.96 270 top
C11  41.76,32.83 270 top
GND  20.17,31.69 180 bottom
IGNORE  17.63,35.12 0 top
LED1  2.77,41.72 270 top
LED2  2.77,44.13 270 top
PA5  20.17,13.91 0 bottom
PC1  15.09,31.69 180 bottom
PC5  2.39,8.83 180 bottom
PC6  2.39,6.29 180 bottom
Q1  6.96,10.23 270 top
R1  23.47,5.27 180 top
R2  5.82,41.72 180 top
R3  40.24,21.78 180 top
R4  5.82,44.13 180 top
R5  34.9,16.57 90 top
R6  3.66,10.61 180 top
R7  25.12,43.5 270 bottom
R8  28.68,43.5 90 bottom
R9  23.09,43.5 90 bottom
R10  19.15,41.72 90 bottom
R11  26.65,43.5 90 bottom
R12  30.2,43.5 270 bottom
R13  21.57,43.5 270 bottom
R14  17.63,41.72 270 bottom
R15  39.86,32.96 90 top
RN1  34.27,12.38 270 top
RN2  43.66,14.29 270 top
SJ1  33.63,3.75 90 bottom
SJ2  19.66,47.44 270 bottom
SJ3  17.12,47.44 270 bottom
SJ4  14.58,47.44 270 bottom
SJ5  12.04,47.44 270 bottom
SW1  33.25,7.05 0 top
SW2  6.33,7.05 180 top
SW3  4.17,37.78 180 top
SWCLK  22.71,31.69 180 bottom
SWDIO  17.63,31.69 180 bottom
TPVCC  10.01,26.61 0 bottom
U1  17.38,7.3 270 top
U2  39.22,14.16 0 top
U3  12.3,22.54 0 top
U4  40.24,19.88 90 top
U5  35.54,40.86 0 bottom
U6  30.33,29.15 0 top
X1  29.7,17.46 270 top
X2  1.88,49.72 0 top
X3  53.19,19.37 270 top
X4  47.86,5.4 90 top

### Tracks (layer width: path | path; a pad name or v marks a point on that pad's centre or on a via)
5V  (via drill 0.4)
  Top 0.406: v49.51,22.04 50.27,21.27 50.27,7.94 49,6.67 46.33,6.67 43.16,3.49 20.93,3.49 | 20.93,3.49 17.38,3.49 15.88,4.99 U1.3 14.28,5.02 C2.1 | 20.93,3.49 X2.5V@0
  Bottom 0.406: v49.51,22.04 50.65,23.18 50.65,27.98 49.32,29.3 49.32,29.35 | 49.32,29.35 50.78,30.8 53.19,30.8 X3.4 X3.2 | X2.ICSP_5V 49.31,29.36 49.32,29.35
ARD_RESET_5V
  Top 0.2: Q1.3 7.85,10.21 7.85,8.96 9.12,7.68 9.12,7.05 | X2.RES 13.69,3.62 9.76,3.62 9.12,4.26 9.12,7.05 | 9.12,7.05 SW2.P$1
ARDUINO-RESET  (via drill 0.4)
  Top 0.2: U3.2 2.77,12.95 v2.77,11.75 2.77,10.61 R6.2
  Bottom 0.2: PC5.TP 2.77,9.21 v2.77,11.75
BERGCLOUD_MISO
  Top 0.2: U3.17 21.87,12.09 22.46,11.5 31.73,11.5 33.02,12.78 RN1.2
BERGCLOUD_MISO_TERM
  Top 0.2: U2.7 U2.6 39.55,10.3 38.46,9.21 35.41,9.21 34.27,10.35 34.27,12.64 34.39,12.77 34.92,12.77 RN1.7
BERGCLOUD_MOSI
  Top 0.2: U3.18 23.14,12.09 23.35,11.88 31.35,11.88 33.05,13.58 RN1.1
BERGCLOUD_MOSI_TERM
  Top 0.2: RN1.8 35.59,13.58 37.59,15.59 U2.18 | U2.18 37.57,17.05 | U2.18 U2.17
BERGCLOUD_SCLK
  Top 0.2: U3.6 7.9,11.83 9.12,10.61 32.49,10.61 33.07,11.18 RN1.4
BERGCLOUD_SCLK_TERM  (via drill 0.4)
  Top 0.2: U2.15 U2.16 38.9,16.12 v38.71,15.94 | v38.71,14.67 38.59,14.67 35.79,11.88 35.79,11.62 35.35,11.18 RN1.5
  Top 0.254: U2.15
  Bottom 0.2: v38.71,14.67 v38.71,15.94
BERGCLOUD_SS
  Top 0.2: U3.8 10.44,11.7 11.15,10.99 31.98,10.99 32.98,11.98 RN1.3
BERGCLOUD_SS_TERM
  Top 0.2: U2.11 U2.12 41.5,16.44 40.36,15.31 38.2,15.31 35.66,12.77 35.66,12.26 35.41,12 34.96,12 RN1.6
BOOTLOAD
  Top 0.2: U3.16 20.61,13.01 20.61,13.84 21.06,14.29 34.9,14.29 | 34.9,14.29 35.28,14.29 36.95,15.95 U2.19 | 34.9,14.29 R5.1
ENABLEINPUT  (via drill 0.4)
  Top 0.2: U3.29 12.98,33.35 13.07,33.45 13.07,33.48 13.69,34.1 27.79,34.1 v27.92,33.97
  Top 0.305: U4.2 v42.27,19.88 42.27,21.4 41.89,21.78 R3.1
  Bottom 0.2: 42.14,19.88 v42.27,19.88 42.01,19.88 v27.92,33.97
FLASH_MISO  (via drill 0.4)
  Top 0.2: v28.43,29.91 U6.8 | U3.10 12.98,11.75 v12.93,11.75
  Bottom 0.2: v28.43,29.91 27.54,29.02 27.54,26.48 27.03,25.97 24.87,25.97 12.93,14.04 v12.93,11.75
FLASH_MOSI  (via drill 0.4)
  Top 0.2: U6.1 28.43,27.75 26.77,29.4 v26.77,29.91 | U3.9 11.72,12.98 11.72,11.81 v11.66,11.75
  Bottom 0.2: U5.P$12 33.98,43.46 29.95,39.44 28.3,39.44 26.77,37.91 26.77,33.59 26.27,33.09 26.27,32.32 26.77,31.81 v26.77,29.91 27.16,29.53 27.16,26.61 26.9,26.35 24.74,26.35 11.66,13.27 v11.66,11.75
FLASH_SCLK  (via drill 0.4)
  Top 0.2: v27.16,32.7 27.66,32.2 27.66,29.66 29.31,28 29.57,28 29.7,27.88 U6.2 29.7,25.21 29.44,24.96 v29.06,24.96 | U3.11 14.25,11.75 v14.2,11.75
  Bottom 0.2: v29.06,24.96 28.81,24.7 24.11,24.7 14.2,14.8 v14.2,11.75 | v27.16,32.7 27.16,37.78 28.43,39.05 30.08,39.05 33.84,42.81 U5.P$11
FLASH_SS  (via drill 0.4)
  Top 0.2: v32.23,24.58 U6.4 | U3.12 15.52,11.75 v15.47,11.75
  Bottom 0.2: 15.47,13.27 v15.47,11.75 15.47,15.56 24.23,24.32 29.44,24.32 29.7,24.58 v32.23,24.58
GND  (via drill 0.4)
  other vias: 25.76,13.02 30.2,45.53 20.3,45.02 16.23,42.61 26.65,41.34 23.4,48.19 28.01,48.19 32.62,48.2 37.19,48.2 41.76,48.2 45.57,46.93 46.84,44.13 46.84,41.09 46.84,38.04 46.84,34.99 29.7,29.91 21.82,39.82 43.54,44.13 43.54,41.09 43.54,38.04 25.63,32.07
  pour Bottom: -1.15,-1.06 56.85,-1.06 56.85,51.94 -1.15,51.94
  pour Top (rank 2): -1.15,-1.06 56.85,-1.06 56.85,51.94 -1.15,51.94
INPUT_MISO  (via drill 0.4)
  Top 0.2: X4.4 49,14.16 49,16.57 48.6,16.97 v45.43,16.97 45.44,16.96 45.44,15.69 45.25,15.49 RN2.8
  Bottom 0.2: X3.21 51.67,9.21 X4.4 | v45.43,16.97 45.44,16.99 45.44,20.89 47.86,23.31 47.86,27.5 46.74,28.61 46.74,29.35 X2.ICSP_MISO 45.61,29.36 45.19,29.78 45.19,44.64 43.28,46.55 34.14,46.55 33.51,45.91 33.51,44.01 29.7,40.2 24.74,40.2 23.09,41.85 R9.1 R13.2 20.64,42.65 18.77,44.52 15.09,44.52 14.58,45.02 SJ4.2
INPUT_MISO_TERM
  Top 0.2: U2.14 U2.13 40.87,17.08 40.87,17.84 41.12,18.1 42.78,18.1 42.99,17.88 RN2.1
INPUT_MOSI
  Top 0.2: X3.19 50.78,12.89 50.78,25.34 49.29,26.82 X2.ICSP_MOSI | X4.5 46.99,14.69 RN2.7
  Bottom 0.15: X3.19 51.9,11.77
  Bottom 0.2: X4.5 48.11,15.56 X3.19 | X2.ICSP_MOSI 49.28,26.83 48.11,28 48.11,30.16 47.6,30.67 46.08,30.67 45.57,31.18 45.57,44.77 43.41,46.93 34.01,46.93 33.12,46.04 33.12,44.13 31.64,42.65 R12.2 R8.1 28.68,41.47 27.79,40.58 24.87,40.58 24.11,41.34 24.11,43.12 23.73,43.5 20.42,43.5 19.03,44.9 17.76,44.9 17.12,45.53 SJ3.2
INPUT_MOSI_TERM
  Top 0.2: U2.2 U2.3 37.59,11.9 40.36,14.67 42.97,14.67 RN2.2
INPUT_NRESET
  Top 0.2: X3.11 53.06,20.77 53.06,6.03 52.43,5.4 50.27,5.4 48.75,3.88 44.3,3.88 43.41,2.99 34.65,2.99 33.63,1.97 X2.A0
  Bottom 0.2: X2.A0 SJ1.1
INPUT_SCLK
  Top 0.2: X2.ICSP_SCK 46.75,26.82 47.86,25.72 47.86,22.04 49.38,20.51 49.38,12 X4.3 45.95,12.38 45.95,12.77 44.83,13.89 RN2.6
  Bottom 0.15: SJ5.2 12.04,46.67
  Bottom 0.2: X2.ICSP_SCK 46.25,26.82 44.81,28.26 44.81,44.52 43.16,46.17 34.27,46.17 33.89,45.79 33.89,43.88 29.82,39.82 24.62,39.82 23.56,40.87 R10.1 R14.2 16.07,40.87 12.04,44.9 SJ5.2 | X3.23 51.67,6.67 X4.3
INPUT_SCLK_TERM
  Top 0.2: U2.4 U2.5 38.9,12.19 40.6,13.89 RN2.3
INPUT_SS  (via drill 0.4)
  Top 0.2: v47.09,31.94 48.24,30.8 48.24,22.16 49.76,20.64 49.76,9.72 47.98,7.94 X4.2 45.32,10.48 45.32,12.64 44.87,13.09 RN2.5
  Bottom 0.2: X3.24 53.19,5.4 50.4,5.4 X4.2 | v47.09,31.94 45.95,33.09 45.95,44.9 43.54,47.31 33.89,47.31 33,46.42 27.92,46.42 26.65,45.15 R11.2 R7.1 25.12,45.15 23.35,46.93 SJ2.2
INPUT_SS_TERM
  Top 0.2: U2.8 U2.9 41.51,11.26 41.51,12.77 41.83,13.09 RN2.4 43.48,13.09 43.66,13.27 43.66,18.35 43.03,18.99 41.89,18.99 41.65,19.23 U4.1
JTCK  (via drill 0.4, 0.4 pad 0.61)
  Top 0.15: v23.09,33.47 23.15,33.41
  Top 0.2: X1.6 33.63,17.46 34.01,17.84 34.01,21.65 33.39,22.28 v33,22.28 | U3.21 23.14,33.42 v23.09,33.47 | v26.01,27.5 26.01,26.61 29.2,23.42 29.19,23.42 v29.19,22.92
  Bottom 0.2: v26.01,27.5 24.36,29.15 24.36,32.2 v23.09,33.47 22.71,33.09 SWCLK.TP | v33,22.28 29.82,22.28 v29.19,22.92
JTDI  (via drill 0.4)
  Top 0.2: v33.38,21.01 33.38,18.86 33.25,18.73 X1.4 | U3.23 20.61,32.08 20.61,31.25 20.8,31.05 21.06,31.05 27.8,24.31 v27.8,23.04
  Bottom 0.2: v33.38,21.01 32.37,21.01 31.85,21.53 28.55,21.53 27.79,22.29 27.79,23.04 v27.8,23.04
JTDO  (via drill 0.4)
  Top 0.2: v33.63,23.81 33.37,23.81 31.73,22.16 X1.2 | U3.22 21.88,32.08 21.88,30.74 24.23,28.39 26.14,28.39 27.03,27.5 27.03,26.1 29.58,23.55 v30.33,23.55
  Bottom 0.2: 33.5,23.81 v33.63,23.81 33.37,23.81 33,23.43 30.45,23.43 v30.33,23.55
JTMS  (via drill 0.4, 0.4 pad 0.61)
  Top 0.15: v19.41,33.47 19.34,33.4
  Top 0.2: v26.77,22.16 26.77,24.83 20.93,30.67 19.79,30.67 19.34,31.12 19.34,32.08 U3.24 19.33,33.38 v19.41,33.47 | X1.7 29.19,16.19 29.44,16.45 29.44,16.83 29.95,17.34 29.95,20 29.7,20.26 v29.7,20.51
  Bottom 0.2: SWDIO.TP 18.01,31.69 19.41,33.09 v19.41,33.47 | 29.44,20.51 v29.7,20.51 28.43,20.51 v26.77,22.16
LED_RED  (via drill 0.4)
  Top 0.15: v14.34,33.45 14.26,33.37
  Top 0.2: v7.72,44.13 R4.1 | U3.28 14.25,33.35 v14.34,33.45
  Bottom 0.2: 14.33,33.47 v14.34,33.45 14.34,38.15 8.36,44.13 v7.72,44.13
N$1
  Top 0.2: LED1.C R2.2
N$3
  Bottom 0.2: SJ2.1 X2.D10
N$4
  Bottom 0.2: SJ3.1 X2.D11
N$5
  Bottom 0.2: SJ4.1 X2.D12
N$6
  Bottom 0.2: SJ5.1 X2.D13
N$8  (via drill 0.4)
  Top 0.2: 36.93,30.33 C7.1 36.81,30.2 v36.81,28.89
  Bottom 0.2: U5.P$2 37.63,36.96 37.95,36.64 37.95,30.42 36.81,29.27 v36.81,28.89
N$9  (via drill 0.4)
  Top 0.2: v35.28,28.89 35.28,30.38 C7.2
  Bottom 0.2: U5.P$1 37.39,36.31 37.57,36.13 37.57,31.56 35.28,29.27 v35.28,28.89
N$10  (via drill 0.4)
  Top 0.2: v38.33,28.89 38.33,30.25 C8.2
  Bottom 0.2: U5.P$3 37.61,37.61 38.33,36.9 v38.33,28.89
N$11
  Top 0.2: LED2.C R4.2
N$12  (via drill 0.4)
  Top 0.2: v39.98,28.89 39.98,30.2 C8.1
  Bottom 0.2: U5.P$4 37.6,38.26 38.71,37.15 38.71,29.66 39.47,28.89 v39.98,28.89
N$14  (via drill 0.4)
  Top 0.2: C5.1 v43.66,34.86
  Bottom 0.2: U5.P$15 35.55,45.4 39.98,45.4 42.14,43.25 42.14,36.13 43.41,34.86 v43.66,34.86
N$18  (via drill 0.4)
  Top 0.2: C11.1 v41.76,34.86
  Bottom 0.2: U5.P$14 39.98,44.77 41.76,42.99 v41.76,34.86
N$19  (via drill 0.4)
  Top 0.2: R15.2 v39.86,34.86
  Bottom 0.2: U5.P$13 39.49,44.11 39.86,43.75 v39.86,34.86
N$20
  Top 0.2: Q1.1 5.45,10.88 5.18,10.61 R6.1
NRESET  (via drill 0.4, 0.4 pad 0.4)
  Top 0.2: 9.18,12.98 U3.7 9.12,12.95 v9.12,11.75 | v33.63,16.19 X1.8 | R1.1 v28.68,5.27 28.68,7.01 SW1.P$1 28.68,7.09
  Bottom 0.2: SJ1.2 31.91,4.2 30.84,5.27 v28.68,5.27 28.68,9.72 | v9.12,11.75 9.12,13.53 8.74,13.91 7.34,13.91 6.96,13.53 6.96,12.13 9.38,9.72 28.68,9.72 | v33.63,16.19 35.16,17.72 42.65,17.72 43.03,17.34 43.03,11.11 42.4,10.48 34.65,10.48 33.89,9.72 28.68,9.72
OE_INPUT->BC  (via drill 0.4)
  Top 0.2: U2.1 v36.3,9.84 | U4.4 39.84,20.53 40.24,20.13 40.24,18.61 v40.36,18.48
  Bottom 0.2: v40.36,18.48 43.03,18.48 43.41,18.1 43.41,10.99 42.52,10.1 36.55,10.1 v36.3,9.84
OLED_D/NC  (via drill 0.4, 0.4 pad 0.4)
  Top 0.2: v11.66,33.47 11.71,33.42 U3.30 | v28.81,38.29 28.68,38.42 v11.66,38.42
  Bottom 0.2: U5.P$10 33.69,42.16 29.82,38.29 v28.81,38.29 | v11.66,33.47 v11.66,38.42
OLED_NRESET  (via drill 0.4, 0.4 pad 0.61)
  Top 0.2: U3.4 5.36,11.83 v5.44,11.75 | v10.14,37.4 27.92,37.4 28.17,37.15 v28.3,37.15
  Bottom 0.2: v5.44,11.75 5.56,11.88 5.56,13.78 7.47,15.69 7.47,34.99 9.88,37.4 v10.14,37.4 | U5.P$9 33.55,41.51 29.19,37.15 v28.3,37.15
OLED_SS  (via drill 0.4)
  Top 0.15: v18.15,33.45 18.07,33.37
  Top 0.2: U3.25 18.06,33.35 v18.15,33.45 | v18.17,36.26 18.3,36.13 v29.7,36.13
  Bottom 0.2: U5.P$8 33.41,40.86 29.7,37.15 v29.7,36.13 | v18.15,33.45 18.14,33.47 18.14,36.23 v18.17,36.26
PC0
  Top 0.2: X1.3 25.89,18.73 25.63,18.99 25.63,25.46 20.8,30.29 19.41,30.29 18.77,30.93 15.72,30.93 15.53,31.12 15.53,32.08 U3.27
PC1_CL/RECLAIM  (via drill 0.4)
  Top 0.15: v16.87,33.47 16.8,33.4
  Top 0.2: U3.26 16.79,33.38 v16.87,33.47 | v16.87,36.26 9.63,36.26 6.71,39.18 SW3.3
  Bottom 0.2: v16.87,36.26 v16.87,33.47 PC1.TP
PC6  (via drill 0.4)
  Top 0.2: U3.3 4.09,11.79 v4.04,11.75
  Bottom 0.2: PC6.TP 4.04,7.94 v4.04,11.75
PTI_DATA_PA5  (via drill 0.4)
  Top 0.2: 19.28,13.04 U3.15 19.33,11.79 v19.28,11.75 | v33.63,14.92 X1.10
  Bottom 0.2: v19.28,11.75 19.28,13.02 PA5.TP 21.19,14.92 v33.63,14.92
PTI_EN_PA4
  Top 0.2: 18.01,13.04 U3.14 18.06,13.95 19.03,14.92 X1.9
VCC  (via drill 0.4)
  Top 0.2: v36.3,35.24 36.93,35.24 37.7,34.48 C9.1 | 9.18,33.9 9.17,33.88 | U2.20 | LED1.A LED2.A 2.01,44.15 v2.01,46.17 | U4.5 39.34,19.24 | C1.1 22.62,7.28 R1.2 | 32.48,33.83 32.23,33.59 | v33.25,35.24 34.77,35.24 35.54,34.48 C10.1
  Top 0.305: C3.1 9.12,33.96 9.18,33.9 | 31.73,23.69 32.49,23.69 33.38,24.58 34.27,24.58 34.65,24.2 34.65,19.62 35.4,18.88 C4.1 | C4.1 U2.20 | C4.1 37.08,18.88 37.44,19.24 38.33,19.24 | 38.33,19.24 39.34,19.24 | R3.2 38.59,21.78 38.33,21.53 38.33,19.24
  Top 0.4: 28.91,35.12 30.19,33.83 32.48,33.83 | 6.2,37.4 7.22,37.4 9.12,35.5 v9.12,35.12
  Top 0.406: 9.12,33.96 v9.12,35.12 28.91,35.12 | 32.23,33.59 U6.5 U6.6 U6.3 30.96,24.45 31.73,23.69 31.73,23.05 30.2,21.53 28.55,21.53 27.66,20.64 X1.1 | LED1.A 2.02,41.2 2.52,40.71 2.9,40.71 6.2,37.4 | C9.1 C10.1 35.51,33.83 C6.1 32.48,33.83 | 9.17,33.88 U3.32 | U1.2 v17.38,7.3 U1.4 C1.1
  Bottom 0.2: 35.55,40.2 U5.P$7 35.52,40.2 33.76,40.2 33,39.44 33,35.5 v33.25,35.24 | U5.P$5 35.52,38.93 34.01,38.93 33.89,38.8 33.89,36.01 34.01,35.88 35.66,35.88 v36.3,35.24 | 13.31,50.87 11.53,50.87 10.77,50.1 10.77,46.55 10.39,46.17 v2.01,46.17 | 13.31,50.87 17.63,50.87 18.39,50.1 18.39,46.42 18.77,46.04 22.58,46.04 23.09,45.53 R9.2 23.77,44.35 24.11,44.01 24.11,43.88 24.49,43.5 25,43.5 25.12,43.37 | 13.31,50.87 13.31,45.28 14.58,44.01 18.52,44.01 19.15,43.37 R10.2 | 25.12,43.37 R7.2 | 25.12,43.37 25.25,43.5 28.55,43.5 28.68,43.63 R8.2
  Bottom 0.406: v17.38,7.3 8.11,7.3 6.33,9.08 6.33,13.78 7.98,15.43 7.98,26.61 | 7.98,26.61 7.98,33.97 v9.12,35.12 | 7.98,26.61 TPVCC.TP

### Text on the board
tNames: AREF | GND | 13 | 12 | 11 | 10 | 9 | 8 | 7 | 6 | 5 | 4 | 3 | 2 | TX | RX | SCREEN | 1 | DevShield v2.7 | 20131015 | MOSI | MISO | SCL | SS | GND | RST | 3.3V | 5V | GND | VIN | A0 | A1 | A2 | A3 | A4 | A5
Document: BERGCloud Dev Shield / / Copyright (c) 2013 BERG Cloud Ltd. http://bergcloud.com/ / / Permission is hereby granted, free of charge, to any person obtaining a copy of this / hardware, software, and associated documentation files (the "Product"), to deal in / the Product without restriction, including without limitation the rights to use, / copy, modify, merge, publish, distribute, sublicense, and/or sell copies of the / Product, and to permit persons to whom the Product is furnished to do so, / subject to the following conditions: / / The above copyright notice and this permission notice shall be included in all / copies or substantial portions of the Product. / / THE PRODUCT IS PROVIDED "AS IS", WITHOUT WARRANTY OF ANY KIND, EXPRESS / OR IMPLIED, INCLUDING BUT NOT LIMITED TO THE WARRANTIES OF MERCHANTABILITY, / FITNESS FOR A PARTICULAR PURPOSE AND NONINFRINGEMENT. IN NO EVENT SHALL / THE AUTHORS OR COPYRIGHT HOLDERS BE LIABLE FOR ANY CLAIM, DAMAGES OR / OTHER LIABILITY, WHETHER IN AN ACTION OF CONTRACT, TORT OR OTHERWISE, / ARISING FROM, OUT OF OR IN CONNECTION WITH THE PRODUCT OR THE USE OR / OTHER DEALINGS IN THE PRODUCT.